# Altium schematic sheet Sensors.SchDoc
size A; SheetNumber: 5; SheetTotal: 5
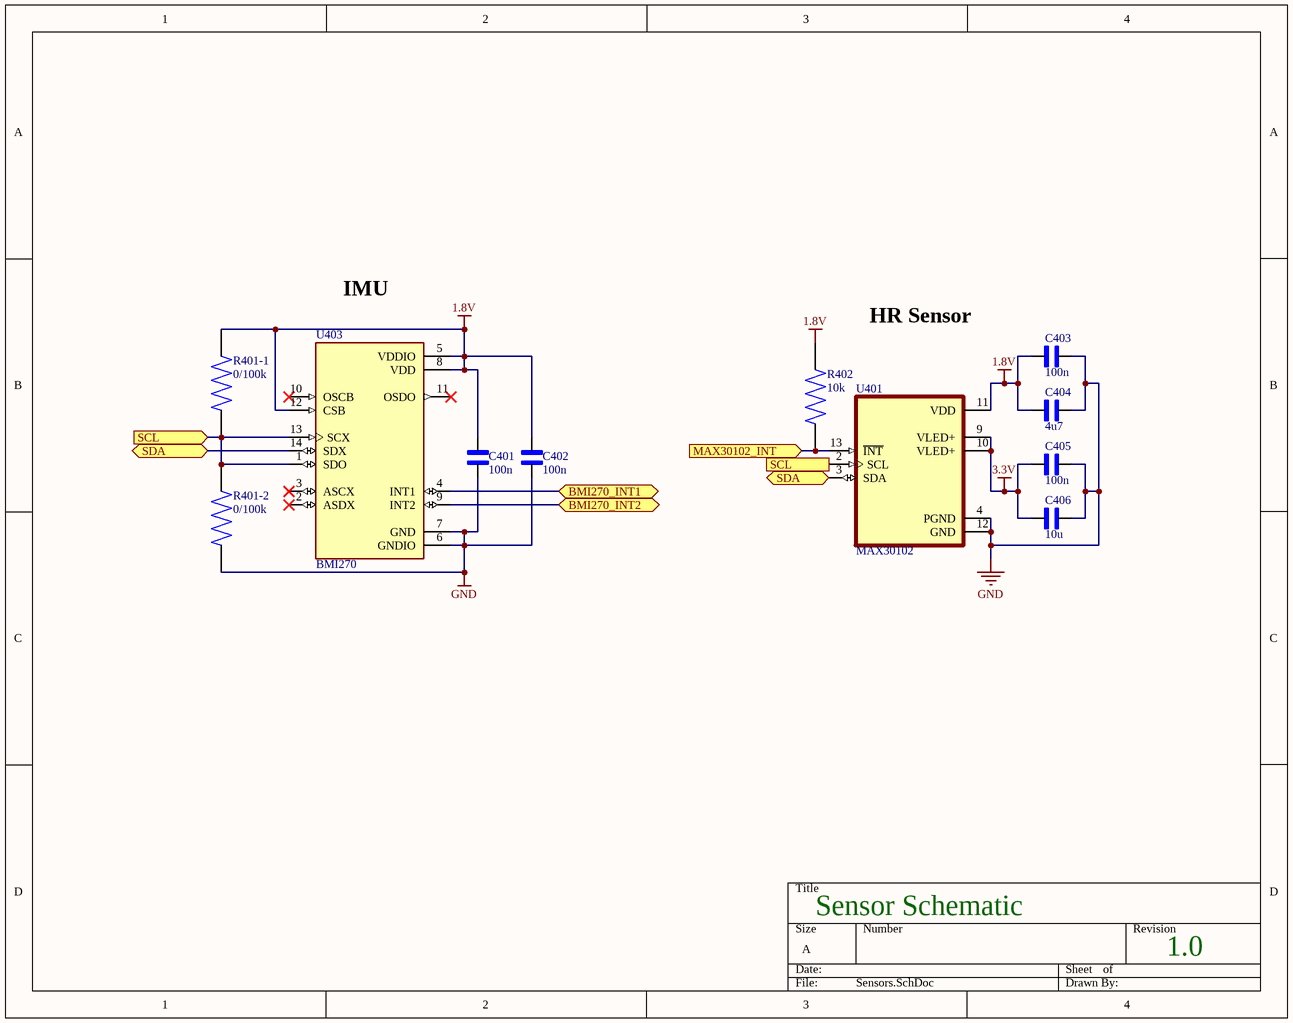
[diagram p0: Sensors.SchDoc]

## Parts
C401  100n  [0402c]
C402  100n  [0402c]
C403  100n  [0402c]
C404  4u7  [0603c]
C405  100n  [0402c]
C406  10u  [0603c]
R401-1  0/100k  [0402r]
R401-2  0/100k  [0402r]
R402  10k  [0402r]
U401  MAX30102  [MAX30102]
U403  BMI270  [BMI270]

## Ports
BMI270_INT1 (bidir), BMI270_INT2 (bidir), MAX30102_INT (in), SCL (in), SDA (bidir)

## Nets
1.8V: C401.2 C402.2 C403.2 C404.2 R401-1.2 R402.2 U401.11(VDD) U403.5(VDDIO) U403.8(VDD) U403.12(CSB)
3.3V: C405.2 C406.2 U401.9(VLED+) U401.10(VLED+)
GND: C401.1 C402.1 C403.1 C404.1 C405.1 C406.1 R401-2.1 U401.4(PGND) U401.12(GND) U403.6(GNDIO) U403.7(GND)
BMI270_INT1: U403.4(INT1) ; port BMI270_INT1
BMI270_INT2: U403.9(INT2) ; port BMI270_INT2
MAX30102_INT: R402.1 U401.13(~{INT}) ; port MAX30102_INT
SCL: R401-1.1 R401-2.2 U401.2(SCL) U403.1(SDO) U403.13(SCX) ; port SCL
SDA: U401.3(SDA) U403.14(SDX) ; port SDA

Not connected (* = marked no-connect by the designer): U403 2(ASDX)* 3(ASCX)* 10(OSCB)* 11(OSDO)*

## Notes on the sheet
- IMU
- HR Sensor
- Sensor Schematic
- 1.0

## Library data of the parts
C401-C403 C405 = 0402c
C404 C406 = 0603c
R401-1 R401-2 R402 = 0402r